# EAGLE design Tiles_Proto2 (EAGLE 7.4.0)
CNAME: Tiles; CREVISION: A; DESIGNER: Simone Mora
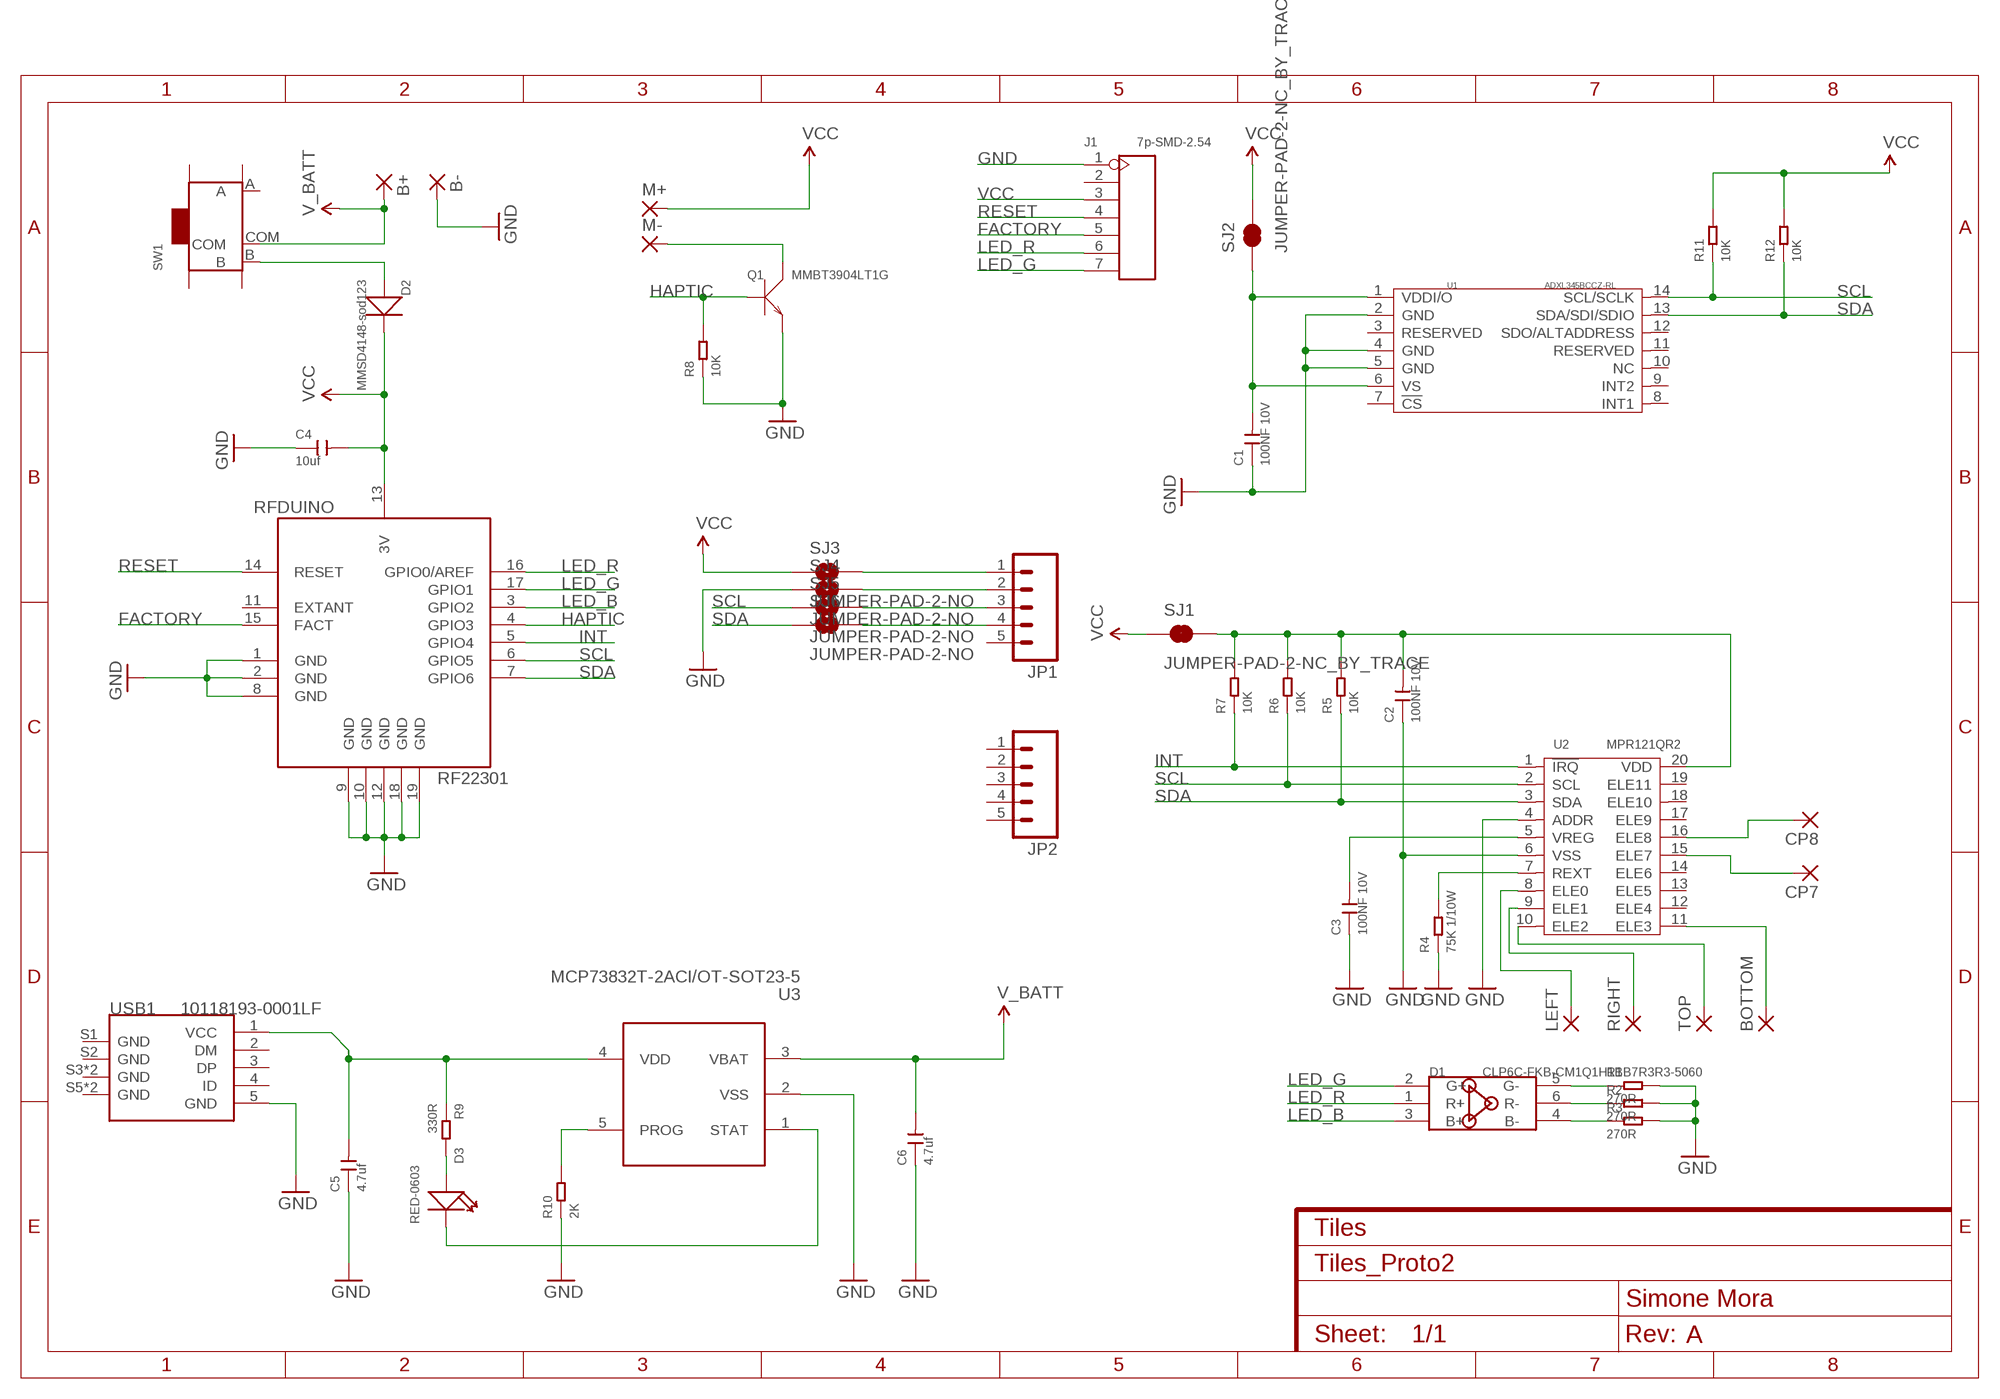
[diagram p0: schematic, sheet 1]

## Parts
B+  SMD2  [SMD1,27-2,54]
B-  SMD2  [SMD1,27-2,54]
BOTTOM  SMD5  [SMD2,54-5,08]
C1  100NF 10V  CERAMIC 100NF-10V-10%-X5R(0402)  [C0402]
C2  100NF 10V  CERAMIC 100NF-10V-10%-X5R(0402)  [C0402]
C3  100NF 10V  CERAMIC 100NF-10V-10%-X5R(0402)  [C0402]
C4  10uf  CERAMIC-10UF-6.3V-20%-X5R(0402)  [C0402]
C5  4.7uf  CERAMIC-4.7UF-6.3V-20%-X5R(0402)  [C0402]
C6  4.7uf  CERAMIC-4.7UF-6.3V-20%-X5R(0402)  [C0402]
CP7  SMD2  [SMD1,27-2,54]
CP8  SMD2  [SMD1,27-2,54]
D1  CLP6C-FKB-CM1Q1H1BB7R3R3-5060  SMD-LED-RGB(6P-L6.0W5.0H4.0MM)  [LED6-SMD-5060]
D2  MMSD4148-sod123  SMD-DIODE-100V-200MA(SOD-123)  [SOD-123]
D3  RED-0603  LED-SMD-RED-DIFFUSED(0603)  [LED-0603]
J1  7p-SMD-2.54  SMD-BLACK-FEMALE-HEADER(7P-2.54)  [H7-SMD-2.54]
JP1  M05PTH  [1X05]
JP2  M05PTH  [1X05]
LEFT  SMD5  [SMD2,54-5,08]
M+  SMD2  [SMD1,27-2,54]
M-  SMD2  [SMD1,27-2,54]
Q1  MMBT3904LT1G  SMD-TRANSISTORS-NPN-40V-200MA-MMBT3904LT1G(SOT-23)  [SOT-23]
R1  270R  SMD-RES-270R-5%-1/4W(1206)  [R0805]
R2  270R  SMD-RES-270R-5%-1/4W(1206)  [R0805]
R3  270R  SMD-RES-270R-5%-1/4W(1206)  [R0805]
R4  75K 1/10W  SMD-RES-75K-1%-1/10W(0603)  [R0603]
R5  10K  SMD-RES-10K-1%-1/10W(0603)  [R0603]
R6  10K  SMD-RES-10K-1%-1/10W(0603)  [R0603]
R7  10K  SMD-RES-10K-1%-1/10W(0603)  [R0603]
R8  10K  SMD-RES-10K-1%-1/10W(0603)  [R0603]
R9  330R  SMD-RES-330R-1%-1/10W(0603)  [R0603]
R10  2K  SMD-RES-2K-5%-1/10W(0603)  [R0603]
R11  10K  SMD-RES-10K-1%-1/10W(0603)  [R0603]
R12  10K  SMD-RES-10K-1%-1/10W(0603)  [R0603]
RFDUINO  RF22301  [RFD22301]
RIGHT  SMD5  [SMD2,54-5,08]
SJ1  JUMPER-PAD-2-NC_BY_TRACE  [PAD-JUMPER-2-NC_BY_TRACE_YES_SILK]
SJ2  JUMPER-PAD-2-NC_BY_TRACE  [PAD-JUMPER-2-NC_BY_TRACE_YES_SILK]
SJ3  JUMPER-PAD-2-NO  [PAD-JUMPER-2-NO_NO_SILK]
SJ4  JUMPER-PAD-2-NO  [PAD-JUMPER-2-NO_NO_SILK]
SJ5  JUMPER-PAD-2-NO  [PAD-JUMPER-2-NO_NO_SILK]
SJ6  JUMPER-PAD-2-NO  [PAD-JUMPER-2-NO_NO_SILK]
SW1  SMD-TOGGLE-SWITCH-ON-ON(3+4P-6.7X2.7MM)  [SW7-SMD-L6.7X2.7X3.2MM]
TOP  SMD5  [SMD2,54-5,08]
U1  ADXL345BCCZ-RL  MOTION/POSITION-ADXL345BCCZ-RL(14P-5.0X3.0MM)  [LGA14-0.8-5.0X3.0MM]
U2  MPR121QR2  TOUCH-MPR121QR2(QFN20)  [QFN20-0.4-3X3M]
U3  MCP73832T-2ACI/OT-SOT23-5  PMIC-MCP73832T-2ACI/OT(SOT23-5)  [SOT-23-5]
USB1  10118193-0001LF  MICRO-USB-SMD-B-(10118193-0001LF)  [MICRO-USB5+6P-SMD-0.65-B]

## Nets
FACTORY: J1.5 RFDUINO.15(FACT)
GND: B-.1(P) C1.1 C2.1 C3.1 C4.1 C5.1 C6.1 J1.1 Q1.2(E) R1.2 R2.2 R3.2 R4.1 R8.1 R10.1 RFDUINO.1(GND) RFDUINO.2(GND) RFDUINO.8(GND) RFDUINO.9(GND) RFDUINO.10(GND) RFDUINO.12(GND) RFDUINO.18(GND) RFDUINO.19(GND) SJ4.1 U1.2(GND) U1.4(GND) U1.5(GND) U2.4(ADDR) U2.6(VSS) U3.2(VSS) USB1.5(GND)
HAPTIC: Q1.1(B) R8.2 RFDUINO.4(GPIO3)
INT: R7.1 RFDUINO.5(GPIO4) U2.1(!IRQ)
LED_B: D1.3(B+) RFDUINO.3(GPIO2)
LED_G: D1.2(G+) J1.7 RFDUINO.17(GPIO1)
LED_R: D1.1(R+) J1.6 RFDUINO.16(GPIO0/AREF)
N$1: D1.5(G-) R1.1
N$2: D1.6(R-) R2.1
N$3: D1.4(B-) R3.1
N$4: C3.2 U2.5(VREG)
N$5: R4.2 U2.7(REXT)
N$6: JP1.1 SJ3.2
N$7: M-.1(P) Q1.3(C)
N$8: C5.2 R9.1 U3.4(VDD) USB1.1(VCC)
N$9: D2.+ SW1.B
N$10: D3.+ R9.2
N$11: D3.- U3.1(STAT)
N$12: R10.2 U3.5(PROG)
N$13: JP1.2 SJ4.2
N$14: JP1.3 SJ5.2
N$15: JP1.4 SJ6.2
N$16: LEFT.1(P) U2.8(ELE0)
N$17: RIGHT.1(P) U2.9(ELE1)
N$18: TOP.1(P) U2.10(ELE2)
N$19: BOTTOM.1(P) U2.11(ELE3)
N$20: CP7.1(P) U2.15(ELE7)
N$21: CP8.1(P) U2.16(ELE8)
N$24: C2.2 R5.2 R6.2 R7.2 SJ1.2 U2.20(VDD)
RESET: J1.4 RFDUINO.14(RESET)
SCL: R6.1 R11.1 RFDUINO.6(GPIO5) SJ5.1 U1.14(SCL/SCLK) U2.2(SCL)
SDA: R5.1 R12.1 RFDUINO.7(GPIO6) SJ6.1 U1.13(SDA/SDI/SDIO) U2.3(SDA)
V_BATT: B+.1(P) C6.2 SW1.COM U3.3(VBAT)
VCC: C4.2 D2.- J1.3 M+.1(P) R11.2 R12.2 RFDUINO.13(3V) SJ1.1 SJ2.2 SJ3.1
VDDI/O: C1.2 SJ2.1 U1.1(VDDI/O) U1.6(VS)
Unconnected: J1.2 JP1.5 JP2.1 JP2.2 JP2.3 JP2.4 JP2.5 RFDUINO.11(EXTANT) SW1.A SW1.SS1 SW1.SS2 SW1.SS3 SW1.SS4 U1.3(RESERVED) U1.7(!CS) U1.8(INT1) U1.9(INT2) U1.10(NC) U1.11(RESERVED) U1.12(SDO/ALTADDRESS) U2.12(ELE4) U2.13(ELE5) U2.14(ELE6) U2.17(ELE9) U2.18(ELE10) U2.19(ELE11) USB1.2(DM) USB1.3(DP) USB1.4(ID) USB1.S1(GND) USB1.S2(GND) USB1.S3(GND) USB1.S4(GND) USB1.S5(GND) USB1.S6(GND)

## Library data of the parts
B+ B- CP7 CP8 M+ M- = wirepad:SMD2: SMD PAD
BOTTOM LEFT RIGHT TOP = wirepad:SMD5: SMD PAD
C1-C3 = Seeed-OPL-Capacitor:CERAMIC 100NF-10V-10%-X5R(0402): 302010037; MPN: CC0402KRX5R6BB104
C4 = Seeed-OPL-Capacitor:CERAMIC-10UF-6.3V-20%-X5R(0402): 302010053; MPN: CC0402MRX5R5BB106
C5 C6 = Seeed-OPL-Capacitor:CERAMIC-4.7UF-6.3V-20%-X5R(0402): 302010019; MPN: CC0402MRX5R5BB475
D1 = Seeed-OPL-Diode:SMD-LED-RGB(6P-L6.0*W5.0*H4.0MM): 304090150; MPN: CLP6C-FKB-CM1Q1H1BB7R3R3
D2 = Seeed-OPL-Diode:SMD-DIODE-100V-200MA(SOD-123): 304010007; MPN: MMSD4148
D3 = Seeed-OPL-Diode:LED-SMD-RED-DIFFUSED(0603): 304090042; MPN: 19-217-R6C-AL1M2VY-3T
J1 = Seeed-OPL-Connector:SMD-BLACK-FEMALE-HEADER(7P-2.54): 320030106; MPN: F171-1107A0BMU01
JP1 JP2 = SparkFun-Connectors:M05: Header 5 Standard 5-pin 0.1" header. Use with straight break away headers (SKU : PRT-00116), right angle break away headers (PRT-00553), swiss pins (PRT-00743), machine pins (PRT-00117), and female headers (PRT-00115). Molex polarized connector foot print use with SKU : PRT-08230 with associated crimp pins and housings.
Q1 = Seeed-OPL-Transistor:SMD-TRANSISTORS-NPN-40V-200MA-MMBT3904LT1G(SOT-23): 305010013; MPN: MMBT3904LT1G
R1-R3 = Seeed-OPL-Resistor:SMD-RES-270R-5%-1/4W(1206): 301010418; MPN: RC1206JR-07270RL
R4 = Seeed-OPL-Resistor:SMD-RES-75K-1%-1/10W(0603): 301010247; MPN: RC0603FR-0775KL
R5-R8 R11 R12 = Seeed-OPL-Resistor:SMD-RES-10K-1%-1/10W(0603): 301010299; MPN: RC0603FR-0710KL
R9 = Seeed-OPL-Resistor:SMD-RES-330R-1%-1/10W(0603): 301010300; MPN: RC0603FR-07330RL
R10 = Seeed-OPL-Resistor:SMD-RES-2K-5%-1/10W(0603): 301010113; MPN: RC0603JR-072KL
RFDUINO = GeekAmmo:RF22301: RFD22301 RFDuino Bluetooth 4.0 Low Energy BLE RF Module With Built-In ARM Cortex M0 Microconroller Hi performance, professional grade Bluetooth 4.0 Low Energy radio transceiver with built-in ARM Cortex M0 microcontroller that can be programmed using the simple-to-use Arduino IDE using RFduino extensions. Built-in user application microcontroller with ADC, I2C, SPI, UART and GPIO. http://www.rfduino.com/
SJ1 SJ2 = SparkFun-Passives:JUMPER-PAD-2-NC_BY_TRACE
SJ3-SJ6 = SparkFun-Passives:JUMPER-PAD-2-NO
SW1 = Seeed-OPL-Switch:SMD-TOGGLE-SWITCH-ON-ON(3+4P-6.7X2.7MM): 311030001
U1 = Seeed-OPL-sensor:MOTION/POSITION-ADXL345BCCZ-RL(14P-5.0X3.0MM): 314080008; MPN: ADXL345BCCZ-RL
U2 = Seeed-OPL-sensor:TOUCH-MPR121QR2(QFN20): 314160001; MPN: MPR121QR2
U3 = Seeed-OPL-ic:PMIC-MCP73832T-2ACI/OT(SOT23-5): 310030238; MPN: MCP73832T-2ACI/OT
USB1 = Seeed-OPL-Connector:MICRO-USB-SMD-B-(10118193-0001LF): 320010003; MPN: 10118193-0001LF

## Board
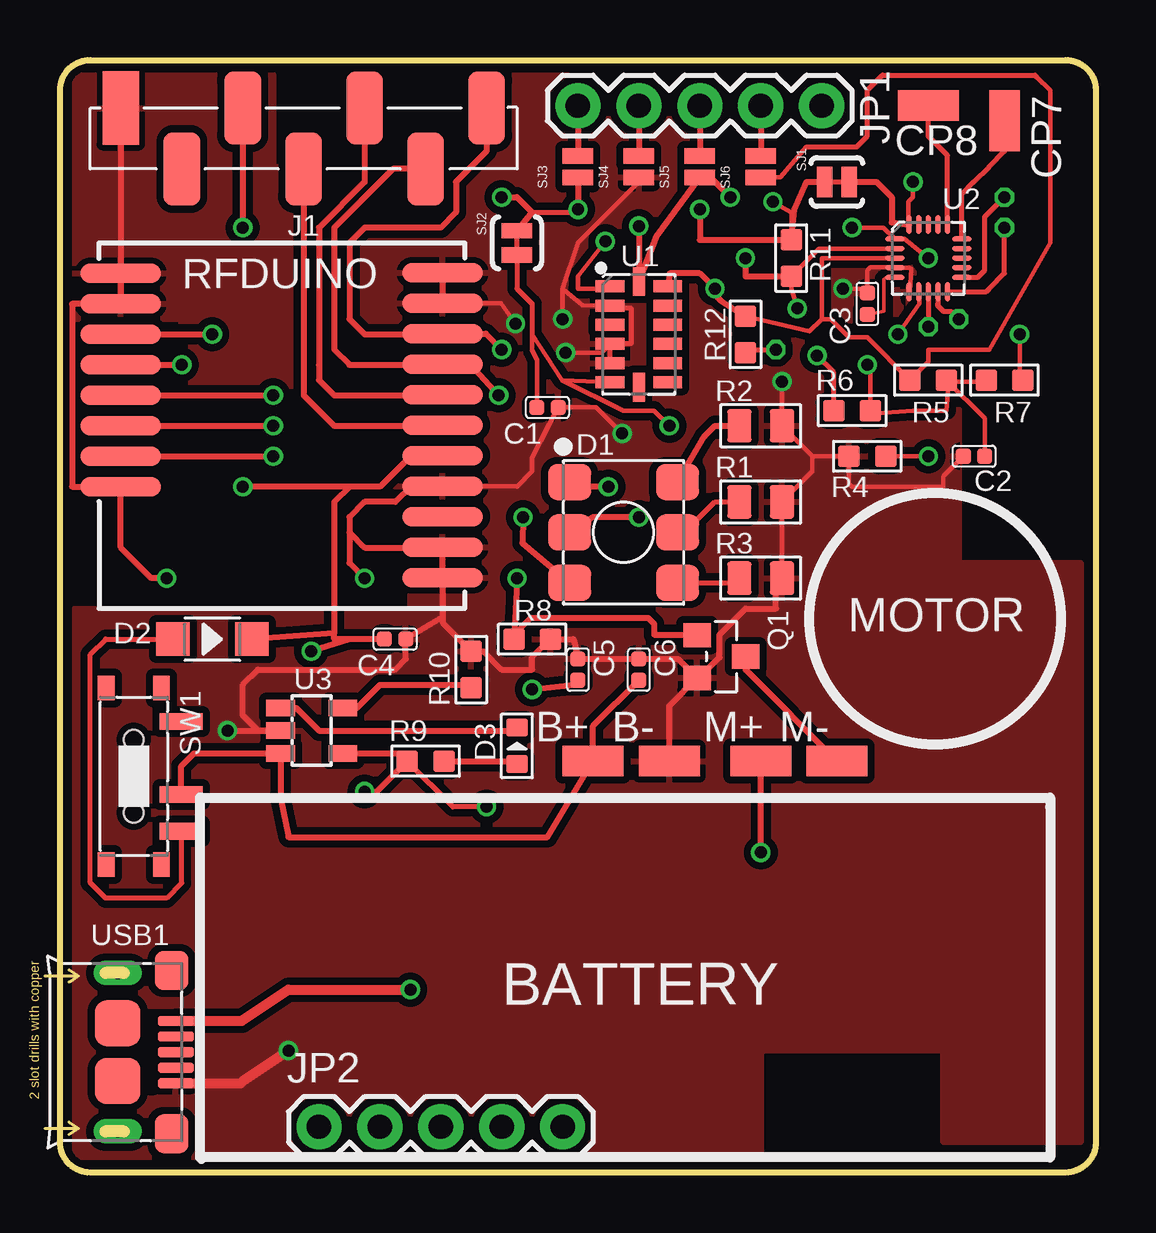
[diagram p1: board, top side]
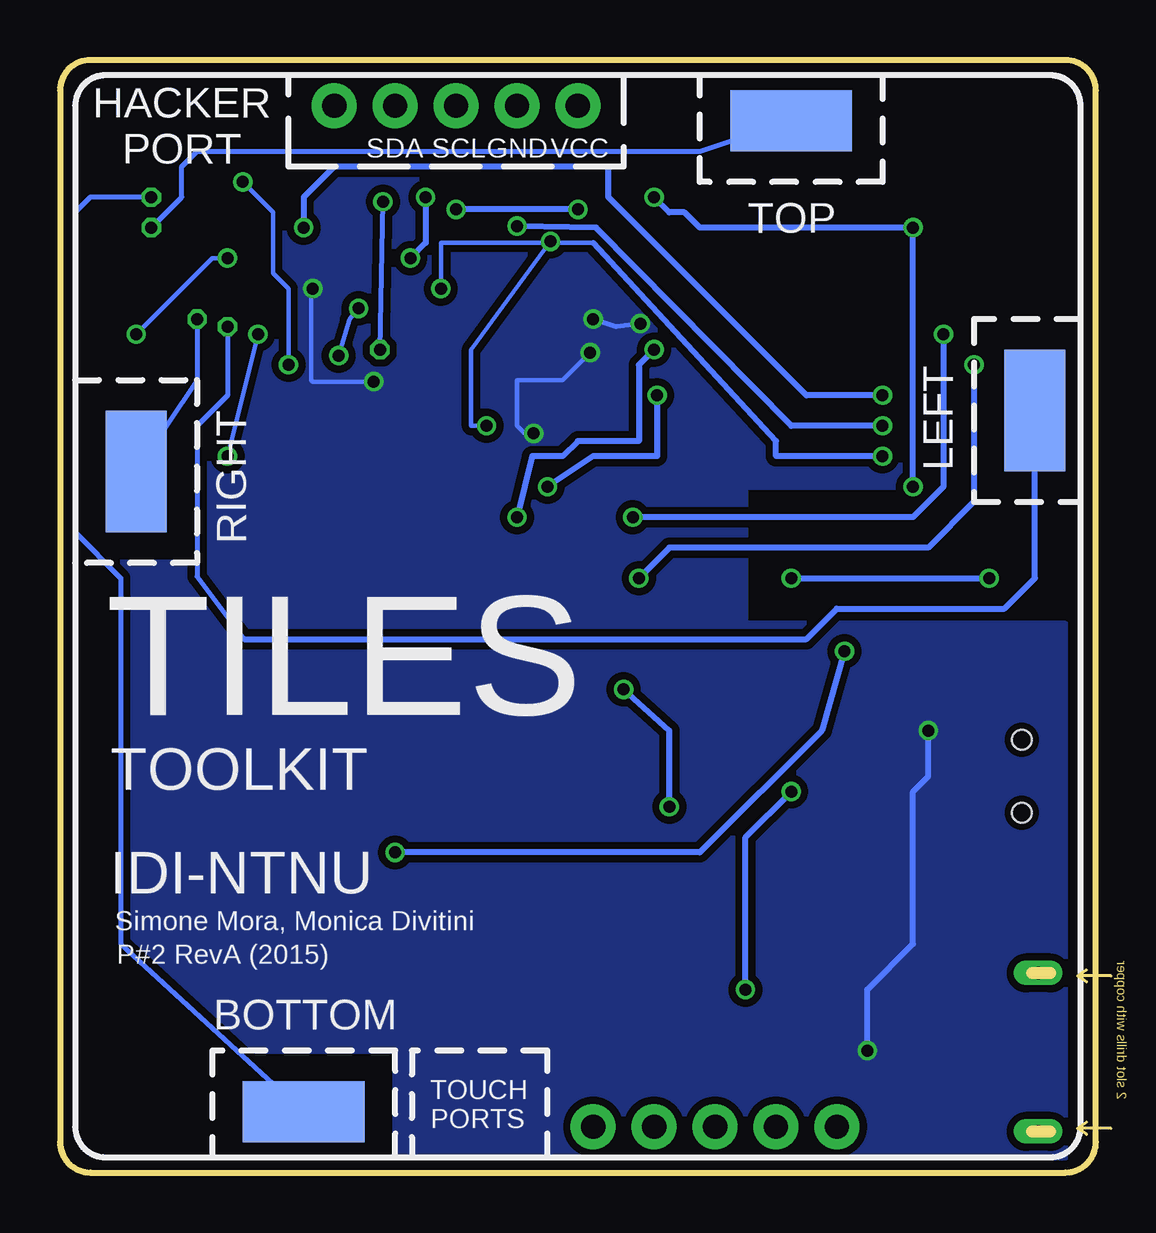
[diagram p2: board, bottom side, seen from below]

Size 43.18 x 46.36 mm. Coordinates in mm from the lower left corner, seen from the top.
Outline: 41.91,0 1.27,0 arc-90 0,1.27 0,45.08 arc-90 1.27,46.36 41.91,46.36 arc-90 43.18,45.08 43.18,1.27 arc-90 41.91,0
Copper layers (1*16): Top 0.035mm / dielectric 1.5mm / Bottom 0.035mm
Design rules "SeeedStudio_2layer_DRU_no_angle_20140221": minimum track width 6mil, minimum drill 12mil, track to track 6mil, track to pad 6mil, pad to pad 6mil, via to via 6mil, smd to smd 0mil, copper to edge 10mil, drill to drill 10mil, minimum pad ring 10mil, minimum via ring 6mil, stop-mask expansion 2mil, vias tented up to drill 100mil, thermal gap 10mil

### Footprints (pad centres in the part's own frame; a part is rotated, then mirrored left to right if it is on the bottom)
SMD1,27-2,54 = smd 1.27 x 2.54: 1 0,0
SMD2,54-5,08 = smd 2.54 x 5.08: 1 0,0
C0402 = smd 0.635 x 0.635: 1 0,0.445; 2 0,-0.445
LED6-SMD-5060 = smd 1.8 x 1.5: 1 -2.25,2.1; 2 -2.25,0; 3 -2.25,-2.1; 4 2.25,-2.1; 5 2.25,0; 6 2.25,2.1
SOD-123 = smd 1.397 x 1.397: + -1.651,0; - 1.651,0
LED-0603 = smd 0.762 x 0.889: + -0.762,0; - 0.762,0
H7-SMD-2.54 = smd 3.048 x 1.524: 1 1.27,7.62; 2 -1.27,5.08; 3 1.27,2.54; 4 -1.27,0; 5 1.27,-2.54; 6 -1.27,-5.08; 7 1.27,-7.62
1X05 = drill 1.016 pad 1.88: 1 0,0; 2 2.54,0; 3 5.08,0; 4 7.62,0; 5 10.16,0
SOT-23 = smd 1.016 x 1.143: 1 -0.889,-1.016; 2 0.889,-1.016; 3 0,1.016
R0805 = smd 1.397 x 1.016: 1 0,0.889; 2 0,-0.889
R0603 = smd 0.889 x 0.889: 1 0,0.762; 2 0,-0.762
RFD22301 = smd 3.353 x 0.813: 1 0,0; 2 0,-1.27; 3 0,-2.54; 4 0,-3.81; 5 0,-5.08; 6 0,-6.35; 7 0,-7.62; 8 0,-8.89; 9 13.411,-12.675; 10 13.411,-11.405; 11 13.411,-10.135; 12 13.411,-8.865; 13 13.411,-7.595; 14 13.411,-6.325; 15 13.411,-5.055; 16 13.411,-3.785; 17 13.411,-2.515; 18 13.411,-1.245; 19 13.411,0.025
PAD-JUMPER-2-NC_BY_TRACE_YES_SILK = smd 0.635 x 1.27: 1 -0.508,0; 2 0.508,0
PAD-JUMPER-2-NO_NO_SILK = smd 0.635 x 1.27: 1 -0.45,0; 2 0.45,0
SW7-SMD-L6.7X2.7X3.2MM = smd 1.8 x 0.7: A 1.978,2.286; B 1.978,-2.286; COM 1.978,-0.762 | smd 0.7 x 1.016: SS1 -1.15,-3.683; SS2 1.15,-3.683; SS3 1.15,3.683; SS4 -1.15,3.683 | hole 0.813: 0,-1.524; 0,1.524
LGA14-0.8-5.0X3.0MM = smd 1.2 x 0.5: 1 -1.2,2; 2 -1.2,1.2; 3 -1.2,0.4; 4 -1.2,-0.4; 5 -1.2,-1.2; 6 -1.2,-2; 8 1.2,-2; 9 1.2,-1.2; 10 1.2,-0.4; 11 1.2,0.4; 12 1.2,1.2; 13 1.2,2 | smd 0.5 x 1.2: 7 0,-2.2; 14 0,2.2
QFN20-0.4-3X3M = smd 0.8 x 0.2: 1 -1.4,0.8; 2 -1.4,0.4; 3 -1.4,0; 4 -1.4,-0.4; 5 -1.4,-0.8; 11 1.4,-0.8; 12 1.4,-0.4; 13 1.4,0; 14 1.4,0.4; 15 1.4,0.8 | smd 0.2 x 0.8: 6 -0.8,-1.4; 7 -0.4,-1.4; 8 0,-1.4; 9 0.4,-1.4; 10 0.8,-1.4; 16 0.8,1.4; 17 0.4,1.4; 18 0,1.4; 19 -0.4,1.4; 20 -0.8,1.4
SOT-23-5 = smd 0.69 x 1.2: 1 -0.95,-1.3; 2 0,-1.3; 3 0.95,-1.3; 4 0.95,1.3; 5 -0.95,1.3
MICRO-USB5+6P-SMD-0.65-B = smd 0.4 x 1.5: 1 -1.3,-0.25; 2 -0.65,-0.25; 3 0,-0.25; 4 0.65,-0.25; 5 1.3,-0.25 | smd 1.6 x 1.4: S1 -3.4,-0.427; S6 3.4,-0.427 | drill 0.508 pad 1.016 long: S2 -3.3,-2.675; S5 3.3,-2.675 | smd 1.9 x 1.9: S3 -1.2,-2.675; S4 1.2,-2.675

### Placement (x,y rotation side)
B+  22.22,17.14 270 top
B-  25.4,17.14 270 top
BOTTOM  33.02,2.54 270 bottom
C1  20.32,31.88 270 top
C2  38.1,29.84 90 top
C3  33.66,36.19 0 top
C4  13.97,22.22 270 top
C5  21.59,20.95 0 top
C6  24.13,20.95 0 top
CP7  39.37,43.81 0 top
CP8  36.2,44.45 90 top
D1  23.49,26.67 0 top
D2  6.35,22.22 0 top
D3  19.05,17.78 90 top
J1  10.16,43.08 90 top
JP1  21.59,44.45 0 top
JP2  10.79,1.91 0 top
LEFT  2.54,31.75 0 bottom
M+  29.21,17.14 270 top
M-  32.38,17.14 270 top
Q1  27.57,21.49 270 top
R1  29.21,27.94 90 top
R2  29.21,31.11 90 top
R3  29.21,24.77 90 top
R4  33.66,29.84 90 top
R5  36.2,33.02 90 top
R6  33.02,31.75 90 top
R7  39.37,33.02 270 top
R8  19.68,22.22 270 top
R9  15.24,17.14 90 top
R10  17.14,20.95 0 top
R11  30.48,38.1 180 top
R12  28.57,34.92 0 top
RFDUINO  2.54,37.47 0 top
RIGHT  40,29.21 0 bottom
SJ1  32.38,41.27 0 top
SJ2  19.05,38.73 90 top
SJ3  21.59,41.91 90 top
SJ4  24.13,41.91 90 top
SJ5  26.67,41.91 90 top
SJ6  29.21,41.91 90 top
SW1  3.08,16.51 0 top
TOP  12.7,43.81 90 bottom
U1  24.13,34.92 0 top
U2  36.2,38.1 0 top
U3  10.5,18.41 270 top
USB1  5.08,5.02 270 top

### Tracks (layer width: path | path; a pad name or v marks a point on that pad's centre or on a via)
FACTORY
  Top 0.254: J1.5 12.7,41.27 10.79,39.37 10.79,33.66 10.79,33.02 11.43,32.38 15.93,32.38 RFDUINO.15
GND  (via drill 0.5)
  Top 0.178: v30.1,32.96 R2.2 31.37,29.84 | v32.64,36.83 33.46,36.83 C3.1 33.66,37.59 33.78,37.72 34.78,37.72 U2.4 35.39,37.7 35.5,37.66 35.43,36.72 U2.6 | 31.37,29.84 R4.1 32.89,28.7 33.02,28.58 36.83,28.58 36.83,29.02 C2.1 | 31.37,29.84 31.37,29.21 R1.2 R3.2 | SJ4.1 24.13,41.27 22.22,39.37 21.59,38.73 20.95,36.83 | 20.95,36.83 21.78,36.13 U1.2 | U1.5 U1.4 22.57,34.16 v21.08,34.16 | RFDUINO.18 18.39,36.22 v18.99,35.37 | v20.95,35.56 20.95,36.19 20.95,36.83 | RFDUINO.12 19.02,28.6 19.05,28.58 19.68,29.21 19.68,29.78 C1.1 22.35,31.88 v23.43,30.8
  Top 0.203: 22.92,34.53 U1.4 22.95,34.54 23.81,34.54 23.81,36 23.05,36 U1.2
  Top 0.254: J1.1 RFDUINO.1 RFDUINO.2 0.51,36.19 0.51,28.58 RFDUINO.8 2.54,26.03 3.81,24.77 v4.44,24.77 | RFDUINO.19 RFDUINO.18 | RFDUINO.12 14.63,28.6 13.97,27.94 12.7,27.94 12.07,27.3 | 12.07,27.3 12.07,26.67 12.7,26.03 15.93,26.03 | 15.93,26.03 RFDUINO.10 | 15.93,26.03 15.93,24.82 RFDUINO.9 15.95,23.13 | 15.95,23.13 C4.1 14.42,21.4 13.97,20.95 8.26,20.95 7.62,20.32 7.62,19.05 8.26,18.41 U3.2 v6.99,18.41 | 12.07,27.3 12.07,25.4 v12.7,24.77 | 15.95,23.13 15.95,22.91 R10.1 17.65,21.72 18.41,20.95 19.68,20.95 19.68,21.46 R8.1 21.4,22.22 C5.1 C6.1 25.77,21.4 Q1.2 | Q1.2 26.64,20.61 27.5,21.46 27.5,22.41 28.57,23.49 29.84,23.49 29.84,24.51 R3.2 | B-.1 25.4,19.45 Q1.2
  Top 0.406: USB1.5 7.53,3.72 7.62,3.81 v9.53,5.08
  Bottom 0.178: v30.1,32.96 32.64,32.96 32.7,33.02 32.7,36.51 v32.64,36.83 | v23.43,30.8 23.81,30.8 24.13,31.11 24.13,33.02 22.22,33.02 v21.08,34.16
  Bottom 0.203: v18.99,35.37 20,35.24 v20.95,35.56
  Bottom 0.254: v12.7,24.77 v4.44,24.77 | v9.53,5.08 9.53,7.62 7.62,9.52 7.62,15.88 6.99,16.51 v6.99,18.41
  pour Top (isolate 0.305): 1.27,45.72 8.89,45.72 8.89,45.08 8.89,41.91 16.51,41.91 16.51,45.72 41.91,45.72 41.91,33.02 37.46,33.02 37.46,25.4 42.55,25.4 42.55,1.27 36.83,1.27 36.83,5.08 29.21,5.08 29.21,0.63 0.64,0.63 0.64,22.86 0.64,23.49 14.61,23.49 14.61,28.58 5.08,28.58 5.08,35.56 0.64,35.56 0.64,45.72
  pour Bottom (isolate 0.305): 0.64,45.72 8.89,45.72 8.89,41.27 16.51,41.27 16.51,45.72 41.91,45.72 41.91,33.02 37.46,33.02 37.46,25.4 42.55,25.4 42.55,1.27 36.83,1.27 36.83,5.08 29.21,5.08 29.21,1.27 29.21,0.63 1.27,0.63 1.27,22.86 14.61,22.86 14.61,28.58 5.08,28.58 5.08,35.56 0.64,35.56
HAPTIC  (via drill 0.5)
  Top 0.254: RFDUINO.4 v5.08,33.66 | v19.05,24.77 19.05,24.64 R8.2 18.92,22.41 19.62,23.11 24.51,23.11 24.77,22.86 24.77,22.41 26.53,22.41 Q1.1
  Bottom 0.254: v5.08,33.66 5.08,27.94 6.99,26.03 17.78,26.03 v19.05,24.77
INT  (via drill 0.5)
  Top 0.178: v33.02,39.37 34.32,39.37 U2.1 35.2,38.9 v36.2,38.1 | v40,34.92 40,33.15 R7.1
  Top 0.254: RFDUINO.5 v8.89,32.38
  Bottom 0.178: v36.2,38.1 36.83,38.1 v40,34.92
  Bottom 0.254: v8.89,32.38 12.07,32.38 20.32,40.64 20.32,41.91 31.75,41.91 33.02,40.64 v33.02,39.37
LED_B  (via drill 0.5)
  Top 0.254: RFDUINO.3 v6.35,34.92 | v19.3,27.3 19.27,26.22 D1.3
  Bottom 0.254: v6.35,34.92 6.35,28.58 7.62,27.3 v19.3,27.3
LED_G  (via drill 0.5)
  Top 0.254: J1.7 17.78,42.55 16.51,41.27 16.51,40 15.88,39.37 12.7,39.37 12.07,38.73 12.07,35.56 12.7,34.92 15.93,34.92 RFDUINO.17 17.75,34.95 v18.41,34.29 | v24.13,27.3 22.86,27.3 22.22,27.3 D1.2
  Bottom 0.254: v18.41,34.29 19.05,33.66 19.05,30.48 21.59,30.48 22.22,29.84 23.49,29.84 v24.13,27.3
LED_R  (via drill 0.5)
  Top 0.254: J1.6 13.88,41.81 11.43,39.37 11.43,34.29 12.07,33.66 15.93,33.66 RFDUINO.16 17.12,33.68 v18.29,32.38 | v22.86,28.58 21.44,28.58 D1.1
  Bottom 0.254: v18.29,32.38 18.29,29.84 20.32,29.84 20.95,29.84 v22.86,28.58
N$1
  Top 0.203: D1.5 26.04,26.67 27.3,27.94 R1.1
N$2
  Top 0.254: D1.6 26.86,30.67 27.3,31.11 R2.1
N$3
  Top 0.203: D1.4 28.13,24.57 R3.1
N$4
  Top 0.152: C3.2 33.59,35.75 34.35,35.88 34.35,37.21 34.42,37.27 34.77,37.27 U2.5
N$5  (via drill 0.5)
  Top 0.178: R4.2 v36.2,29.84 | v34.92,34.92 35.81,36.19 35.81,36.68 U2.7
  Bottom 0.178: v36.2,29.84 v34.92,34.92
N$6
  Top 0.254: JP1.1 SJ3.2
N$7
  Top 0.254: Q1.3 28.59,20.94 M-.1
N$8  (via drill 0.5)
  Top 0.203: v17.78,15.24 16.38,15.24 R9.1
  Top 0.254: U3.4 14.16,17.46 R9.1 13.21,15.88 v12.7,15.88 | v19.68,20.13 21.4,20.32 C5.2
  Top 0.406: USB1.1 7.59,6.32 7.62,6.35 9.53,7.62 v14.61,7.62
  Bottom 0.254: v14.61,7.62 14.61,13.97 v12.7,15.88 | v17.78,15.24 17.78,18.41 v19.68,20.13
N$9
  Top 0.203: SW1.B 5.06,12.09 5.08,12.06 4.44,11.43 1.91,11.43 1.27,12.06 1.27,21.59 1.91,22.22 D2.+
N$10
  Top 0.254: R9.2 18.92,17.14 D3.+
N$11
  Top 0.254: U3.1 9.85,19.36 10.79,18.41 18.92,18.41 D3.-
N$12
  Top 0.254: U3.5 12.38,19.36 13.34,20.32 17.02,20.32 R10.2
N$13
  Top 0.254: JP1.2 SJ4.2
N$14
  Top 0.254: JP1.3 SJ5.2
N$15
  Top 0.254: JP1.4 SJ6.2
N$16  (via drill 0.5)
  Top 0.203: U2.8 v36.2,35.24
  Bottom 0.203: v36.2,35.24 36.2,32.38 37.46,31.11 37.46,25.4 37.46,24.83 35.5,22.22
  Bottom 0.254: 35.5,22.22 12.07,22.22 10.79,23.49 3.81,23.49 2.54,24.77 LEFT.1
N$17  (via drill 0.5)
  Top 0.203: U2.9 36.59,36.21 36.58,36.19 36.58,36.13 36.83,35.88 37.15,35.88 v37.46,35.56
  Bottom 0.203: v37.46,35.56 37.46,33.02 RIGHT.1
N$18  (via drill 0.5)
  Top 0.203: U2.10 38.6,36.7 38.73,36.83 39.37,37.47 v39.37,39.37
  Bottom 0.203: v39.37,39.37 38.1,40.64 38.1,41.91 37.46,42.55 17.78,42.55 16.51,42.55 TOP.1
N$19  (via drill 0.5)
  Top 0.203: U2.11 38.25,37.3 38.55,37.59 38.55,39.81 v39.37,40.64
  Bottom 0.203: v39.37,40.64 41.91,40.64 42.55,40 42.55,26.67 40.64,24.77 40.64,9.52 BOTTOM.1
N$20
  Top 0.203: U2.15 37.59,40.77 38.1,41.27 38.73,41.91 39.37,42.55 CP7.1
N$21
  Top 0.203: U2.16 36.99,42.38 36.83,42.55 36.2,43.18 CP8.1
N$24  (via drill 0.5)
  Top 0.178: 37.02,32.96 37.02,32.45 36.96,31.75 36.83,31.75 35.56,31.75 33.78,31.62 R6.2 33.78,33.53 v33.66,33.66 | 37.02,32.96 R5.2 38.55,31.43 C2.2 | v35.56,41.27 35.56,40.64 35.37,40.45 35.37,39.52 U2.20 | 37.02,32.96 38.55,32.96 R7.2
  Top 0.254: SJ1.2 33.66,41.27 34.04,41.27 34.67,40.64 34.67,39.59 U2.20
  Bottom 0.178: v33.66,33.66 33.66,36.83 34.29,37.47 34.29,40 v35.56,41.27
RESET
  Top 0.254: J1.4 10.16,35.56 10.16,32.38 11.43,31.11 15.93,31.11 RFDUINO.14
SCL  (via drill 0.5)
  Top 0.178: U2.2 31.64,38.5 R11.1 30.48,36.83 v30.73,36
  Top 0.203: R6.1 32.26,33.34 v31.56,34.04
  Top 0.254: RFDUINO.6 v8.89,31.11 | v24.13,39.43 U1.14 24.88,39.03 SJ5.1 27.12,41.46 v27.94,40.64 | v28.57,38.1 28.57,37.34 R11.1
  Bottom 0.178: v30.73,36 31.12,35.56 v31.56,34.04
  Bottom 0.254: v8.89,31.11 12.7,31.11 20.83,39.37 v24.13,39.43 | v27.94,40.64 27.94,38.73 v28.57,38.1
SDA  (via drill 0.5)
  Top 0.178: R12.1 31.24,35.05 31.75,35.56 | 31.75,35.56 31.75,38.1 U2.3 | 31.75,35.56 32.13,35.56 32.89,34.8 33.66,34.8 R5.1 36.2,33.78 36.2,34.29 37.46,34.29 38.73,34.29 41.27,38.73 41.27,45.08 40.7,45.66 | SJ6.1 30.03,41.46 31.12,42.74
  Top 0.203: 31.12,42.74 33.21,42.74 33.66,43.18 33.66,45.08 34.29,45.72 40.64,45.72 40.7,45.66
  Top 0.254: RFDUINO.7 v8.89,29.84 | U1.13 25.42,37.47 26.67,37.47 v27.3,36.83 27.3,36.58 27.56,36.32 R12.1
  Bottom 0.178: 20.95,38.73 27.3,38.73 v27.3,36.83
  Bottom 0.254: v8.89,29.84 13.34,29.84 13.34,30.48 20.95,38.73
V_BATT
  Top 0.254: SW1.COM 5.06,16.93 5.59,17.46 U3.3 9.2,15.57 9.53,13.97 20.32,13.97 B+.1 22.22,18.61 C6.2
VCC  (via drill 0.5)
  Top 0.203: R12.2 28.7,34.29 v29.84,34.29 | v29.72,40.45 30.48,40 R11.2 | 19.68,40 21.46,40 v21.59,40.13
  Top 0.254: J1.3 v7.62,39.37 | v18.41,40.64 19.05,40.64 19.68,40 SJ2.2 | SJ3.1 v21.59,40.13 | v26.67,40.13 26.67,38.86 R11.2 30.61,40.13 31.12,41.27 SJ1.1 | RFDUINO.13 14.63,29.87 13.34,28.58 | 13.34,28.58 v7.62,28.58 | 13.34,28.58 12.07,28.58 11.43,27.94 11.43,22.48 | 11.43,22.48 D2.- | 11.43,22.48 11.43,22.22 C4.2 12.07,22.22 v10.48,21.72 | v29.21,13.34 M+.1
  Bottom 0.203: v29.84,34.29 v29.72,40.45
  Bottom 0.254: v18.41,40.64 17.78,40 17.14,40 16.51,39.37 v7.62,39.37 v7.62,28.58 | v21.59,40.13 v26.67,40.13 | v10.48,21.72 11.43,18.41 16.51,13.34 v29.21,13.34
VDDI/O  (via drill 0.5)
  Top 0.178: 20.93,33.02 19.68,34.92 19.68,34.29 19.88,33.85 C1.2 | 20.93,33.02 U1.6 | 20.93,33.02 23.49,31.75 24.77,31.75 v25.4,31.11 | v22.73,38.8 21.59,37.34 21.59,36.83 22.83,36.83 U1.1
  Top 0.203: SJ2.1 19.05,36.83 19.68,36.19 19.68,34.92
  Bottom 0.178: v25.4,31.11 26.04,31.11 26.04,34.29 v22.73,38.8

### Text on the board
tPlace: MOTOR | BATTERY
bPlace: HACKER / PORT | VCC | GND | SCL | SDA | TILES | TOOLKIT | IDI-NTNU | Simone Mora, Monica Divitini | P#2 RevA (2015) | TOUCH / PORTS